# Altium project IntelliModule-Alpha-Baseboard.PrjPcb (part 2 of 2)
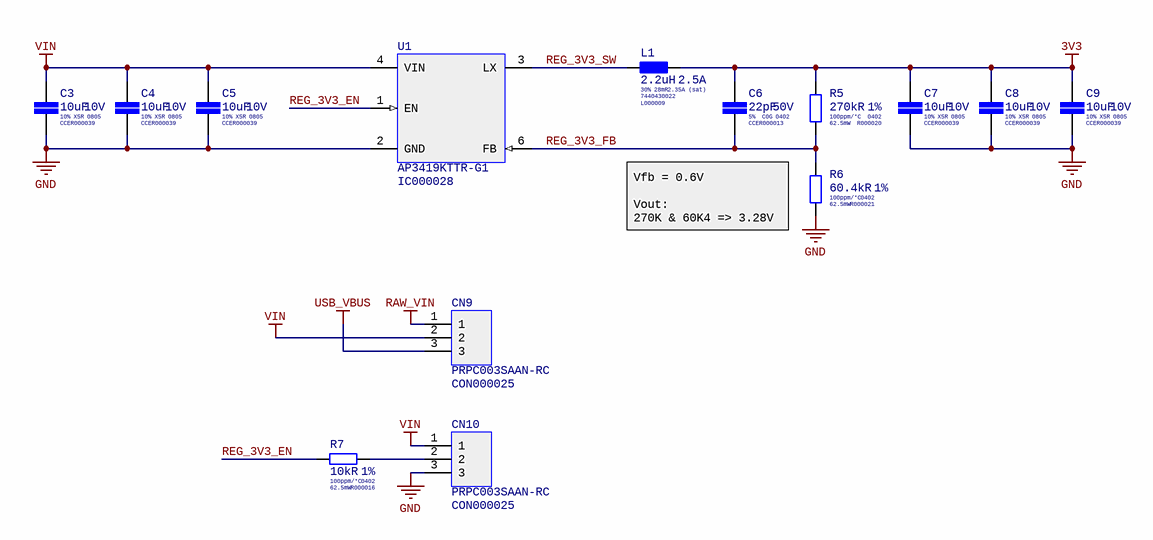
[diagram p4: [04] - Power Supply.SchDoc]

## Nets that join several sheets
3V3: [02] - Module Connector (C1.1 CN1.2 CN1.4), [03] - External Connectors (11 pins), [04] - Power Supply (6 pins)
GND: [02] - Module Connector (14 pins), [03] - External Connectors (34 pins), [04] - Power Supply (9 pins)
RAW_VIN: [03] - External Connectors (CN4.26), [04] - Power Supply (CN9.1)
USB_VBUS: [03] - External Connectors (CN4.28 CN6.1), [04] - Power Supply (CN9.3)
VBAT_MCU: [02] - Module Connector (CN1.6), [03] - External Connectors (CN4.27 CN8.1)
MCU_BOOT0: [02] - Module Connector (CN1.5), [03] - External Connectors (R4.1)
MCU_PA0_GPIO0: [02] - Module Connector (CN1.35), [03] - External Connectors (CN4.5)
MCU_PA1_AUX1: [02] - Module Connector (CN1.8), [03] - External Connectors (CN3.4)
MCU_PA2_USART2_TX: [02] - Module Connector (CN1.34), [03] - External Connectors (CN3.26)
MCU_PA3_USART2_RX: [02] - Module Connector (CN1.36), [03] - External Connectors (CN3.28)
MCU_PA5_SPI1_SCK: [02] - Module Connector (CN1.19), [03] - External Connectors (CN3.17)
MCU_PA6_SPI1_MISO: [02] - Module Connector (CN1.21), [03] - External Connectors (CN3.19)
MCU_PA7_SPI1_MOSI: [02] - Module Connector (CN1.23), [03] - External Connectors (CN3.21)
MCU_PA9_USART1_TX: [02] - Module Connector (CN1.30), [03] - External Connectors (CN3.20 CN5.8)
MCU_PA10_USART1_RX: [02] - Module Connector (CN1.32), [03] - External Connectors (CN3.22 CN5.9)
MCU_PA13_JTAG_TMS_SWDIO: [02] - Module Connector (CN1.11), [03] - External Connectors (CN3.11 CN5.5)
MCU_PA14_JTAG_TCK_SWCLK: [02] - Module Connector (CN1.13), [03] - External Connectors (CN3.13 CN5.3)
MCU_PA15_JTAG_TDI: [02] - Module Connector (CN1.7), [03] - External Connectors (CN3.7 CN5.6)
MCU_PB3_JTAG_TDO_TRACE_SWO: [02] - Module Connector (CN1.9), [03] - External Connectors (CN3.9 CN5.7)
MCU_PB6_I2C1_SCL: [02] - Module Connector (CN1.20), [03] - External Connectors (CN3.8)
MCU_PB7_I2C1_SDA: [02] - Module Connector (CN1.22), [03] - External Connectors (CN3.10)
MCU_PB10_I2C2_SCL: [02] - Module Connector (CN1.26), [03] - External Connectors (CN3.16)
MCU_PB11_I2C2_SDA: [02] - Module Connector (CN1.24), [03] - External Connectors (CN3.14)
MCU_PB13_SPI2_SCK: [02] - Module Connector (CN1.27), [03] - External Connectors (CN3.25)
MCU_PB14_SPI2_MISO: [02] - Module Connector (CN1.29), [03] - External Connectors (CN3.27)
MCU_PB15_SPI2_MOSI: [02] - Module Connector (CN1.31), [03] - External Connectors (CN3.29)
MCU_PC0_GPIO1: [02] - Module Connector (CN1.37), [03] - External Connectors (CN4.7)
MCU_PC1_GPIO2: [02] - Module Connector (CN1.39), [03] - External Connectors (CN4.9)
MCU_PC2_GPIO3: [02] - Module Connector (CN1.41), [03] - External Connectors (CN4.11)
MCU_PC3_GPIO4: [02] - Module Connector (CN1.43), [03] - External Connectors (CN4.15)
MCU_PC4_GPIO5: [02] - Module Connector (CN1.45), [03] - External Connectors (CN4.17)
MCU_PC5_GPIO6: [02] - Module Connector (CN1.47), [03] - External Connectors (CN4.19)
MCU_PC7_GPIO8: [02] - Module Connector (CN1.50), [03] - External Connectors (CN4.18)
MCU_PC8_GPIO9: [02] - Module Connector (CN1.48), [03] - External Connectors (CN2.7 CN4.16)
MCU_PC9_GPIO10: [02] - Module Connector (CN1.46), [03] - External Connectors (CN2.8 CN4.12)
MCU_PC10_GPIO11: [02] - Module Connector (CN1.44), [03] - External Connectors (CN2.1 CN4.10)
MCU_PC11_GPIO12: [02] - Module Connector (CN1.42), [03] - External Connectors (CN2.2 CN4.8)
MCU_PC12_GPIO13: [02] - Module Connector (CN1.40), [03] - External Connectors (CN2.5 CN4.6)
MCU_PD2_GPIO7: [02] - Module Connector (CN1.49), [03] - External Connectors (CN2.3 CN4.21)
MCU_RESETn: [02] - Module Connector (CN1.3), [03] - External Connectors (5 pins)
MCU_USB_D_N: [02] - Module Connector (CN1.12), [03] - External Connectors (CN6.2)
MCU_USB_D_P: [02] - Module Connector (CN1.14), [03] - External Connectors (CN6.3)